# EAGLE design teploblinscheme (EAGLE 9.6.1)
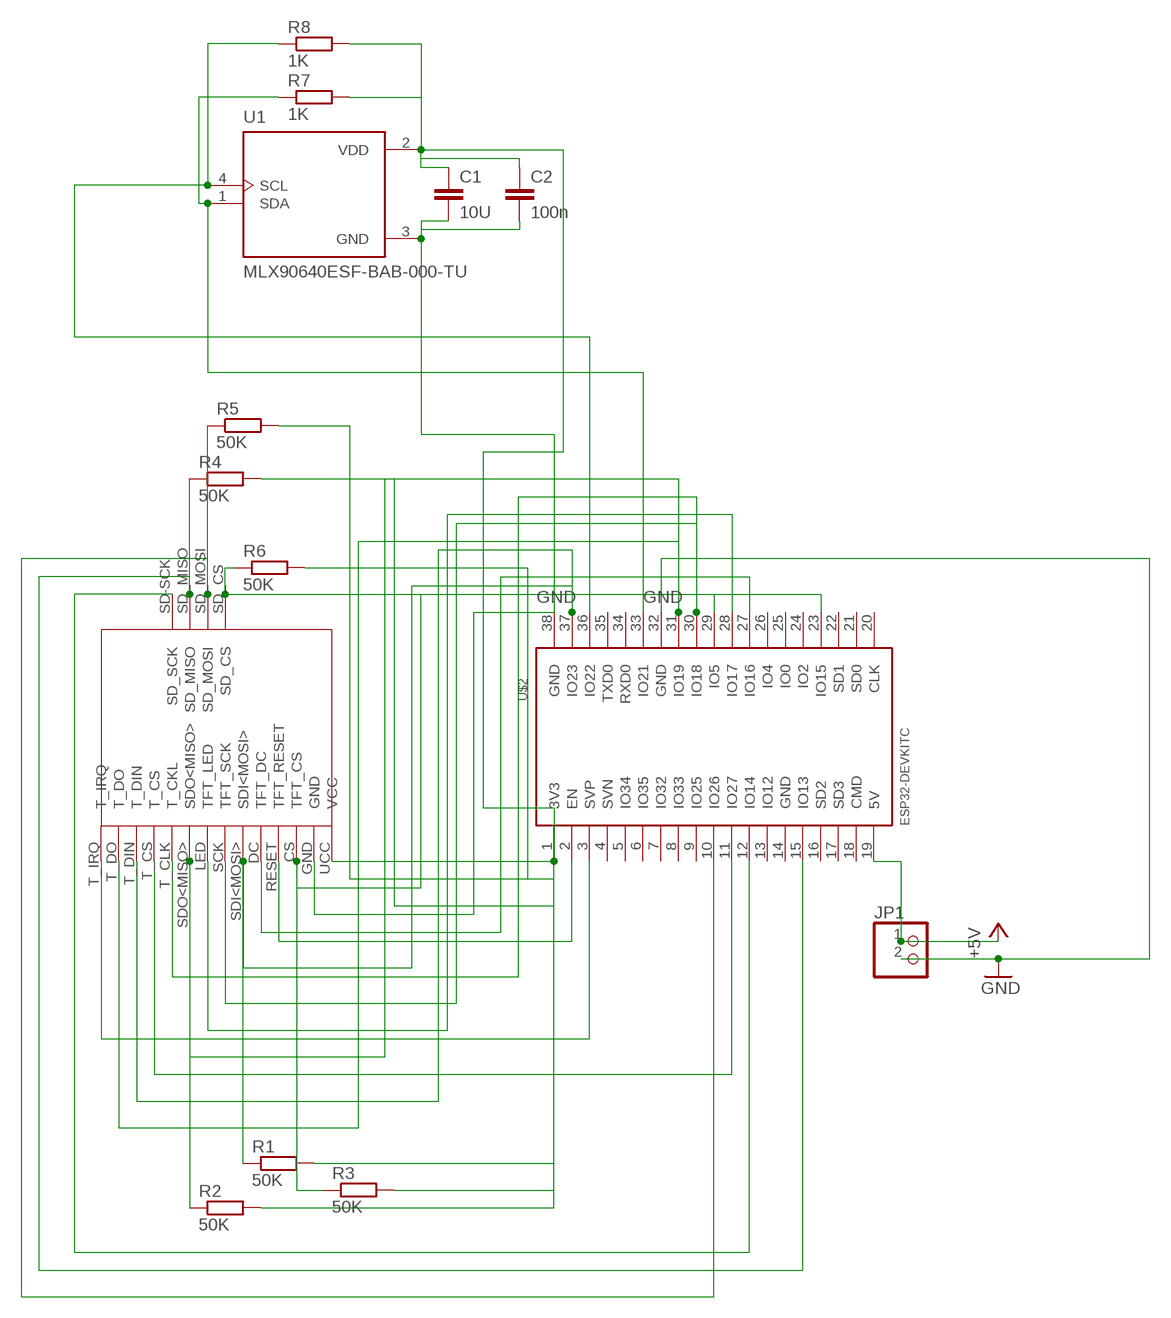
[diagram p0: schematic, sheet 1]

## Parts
C1  10U  C2,5-3  [C2.5-3]
C2  100n  C2,5-3  [C2.5-3]
JP1  PINHD-1X2  [1X02]
R1  50K  R-EU_0207/10  [0207/10]
R2  50K  R-EU_0207/10  [0207/10]
R3  50K  R-EU_0207/10  [0207/10]
R4  50K  R-EU_0207/10  [0207/10]
R5  50K  R-EU_0207/10  [0207/10]
R6  50K  R-EU_0207/10  [0207/10]
R7  1K  R-EU_0204/7  [0204/7]
R8  1K  R-EU_0204/7  [0204/7]
U1  MLX90640ESF-BAB-000-TU  [TO292P945H1165-4]
U$1  ILI9341  [SKR1]
U$2  ESP32DEVKITC  [ESP32-DEVKITC]

## Nets
+5V [supplay]: JP1.1 U$2.19(5V)
GND: C1.2 C2.2 JP1.2 U1.3(GND) U$2.32(GND)
N$1: U$1.SCK(TFT_SCK) U$1.T_CLK(T_CKL) U$2.30(IO18)
N$2 [supplay]: R1.2 R2.2 R3.2 R4.2 R5.2 R6.2 U$1.UCC(VCC) U$2.1(3V3)
N$3: U$1.LED(TFT_LED) U$2.28(IO17)
N$4 [supplay]: R3.1 U$1.CS(TFT_CS) U$2.29(IO5)
N$5: U$1.RESET(TFT_RESET) U$2.2(EN)
N$6: U$1.DC(TFT_DC) U$2.27(IO16)
N$7 [supplay]: R1.1 U$1.SDI<MOSI> U$1.T_DIN U$2.37(IO23)
N$8 [supplay]: R2.1 U$1.SDO<MISO> U$1.T_DO U$2.31(IO19)
N$9: U$1.GND U$2.38(GND)
N$10 [supplay]: R4.1 U$1.SD_MISO U$2.15(IO13)
N$11: U$1.T_CS U$2.11(IO27)
N$12 [supplay]: R5.1 U$1.SD_MOSI U$2.10(IO26)
N$13 [supplay]: R6.1 U$1.SD_CS U$2.23(IO15)
N$14: U$1.T_IRQ U$2.3(SVP)
N$15 [supplay]: R8.1 U1.4(SCL) U$2.36(IO22)
N$16 [supplay]: C1.1 C2.1 R7.2 R8.2 U1.2(VDD)
N$17 [supplay]: R7.1 U1.1(SDA) U$2.33(IO21)
N$18: U$1.SD-SCK(SD_SCK) U$2.12(IO14)
Unconnected: U$2.4(SVN) U$2.5(IO34) U$2.6(IO35) U$2.7(IO32) U$2.8(IO33) U$2.9(IO25) U$2.13(IO12) U$2.14(GND) U$2.16(SD2) U$2.17(SD3) U$2.18(CMD) U$2.20(CLK) U$2.21(SD0) U$2.22(SD1) U$2.24(IO2) U$2.25(IO0) U$2.26(IO4) U$2.34(RXD0) U$2.35(TXD0)

## Library data of the parts
C1 C2 = capacitor-wima:C: CAPACITOR naming: grid - package width
JP1 = pinhead:PINHD-1X2: PIN HEADER
R1-R8 = rcl:R-EU_: RESISTOR, European symbol; SPICEPREFIX: R
U1 = teploblinEkran:MLX90640ESF-BAB-000-TU: SENSOR DGTL -40C-85C TO39; AVAILABILITY: Unavailable; DESCRIPTION: Thermal Image Sensor 32H x 24V TO-39; MF: Melexis Technologies NV; MP: MLX90640ESF-BAB-000-TU; PACKAGE: TO-39 Melexis Technologies NV; PRICE: None
U$1 = teploblinEkran:ILI9341
U$2 = teploblinEkran:ESP32DEVKITC

## Net classes
0 default: width 0.406 mm
1 supplay: width 0.813 mm

## Board
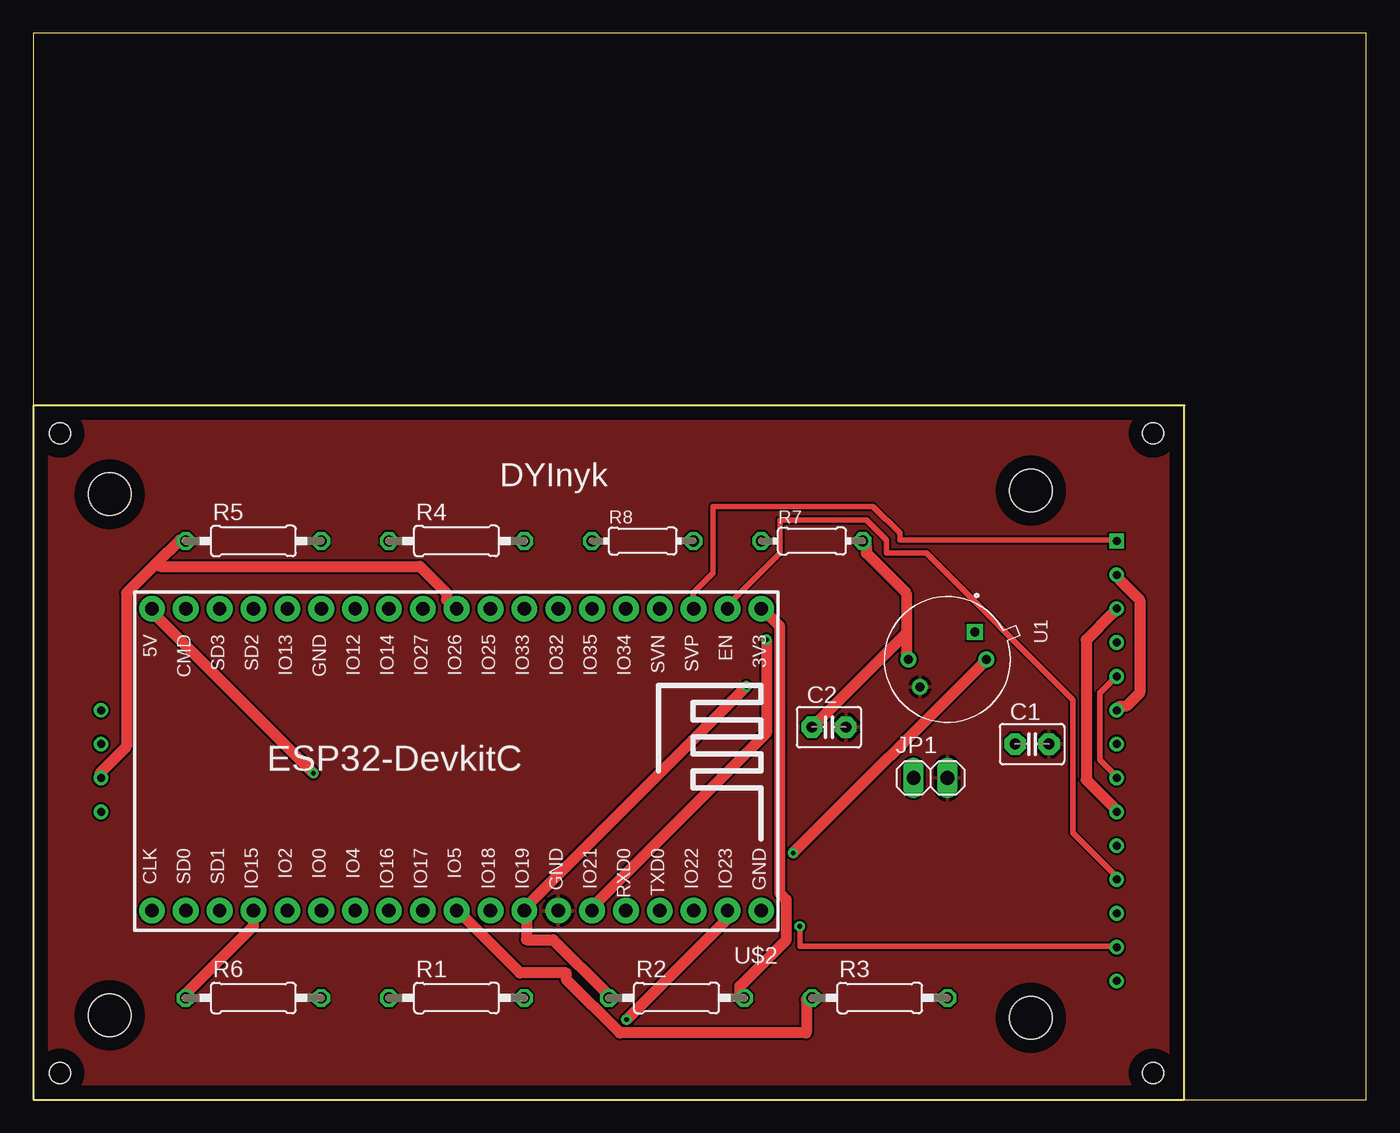
[diagram p1: board, top side]
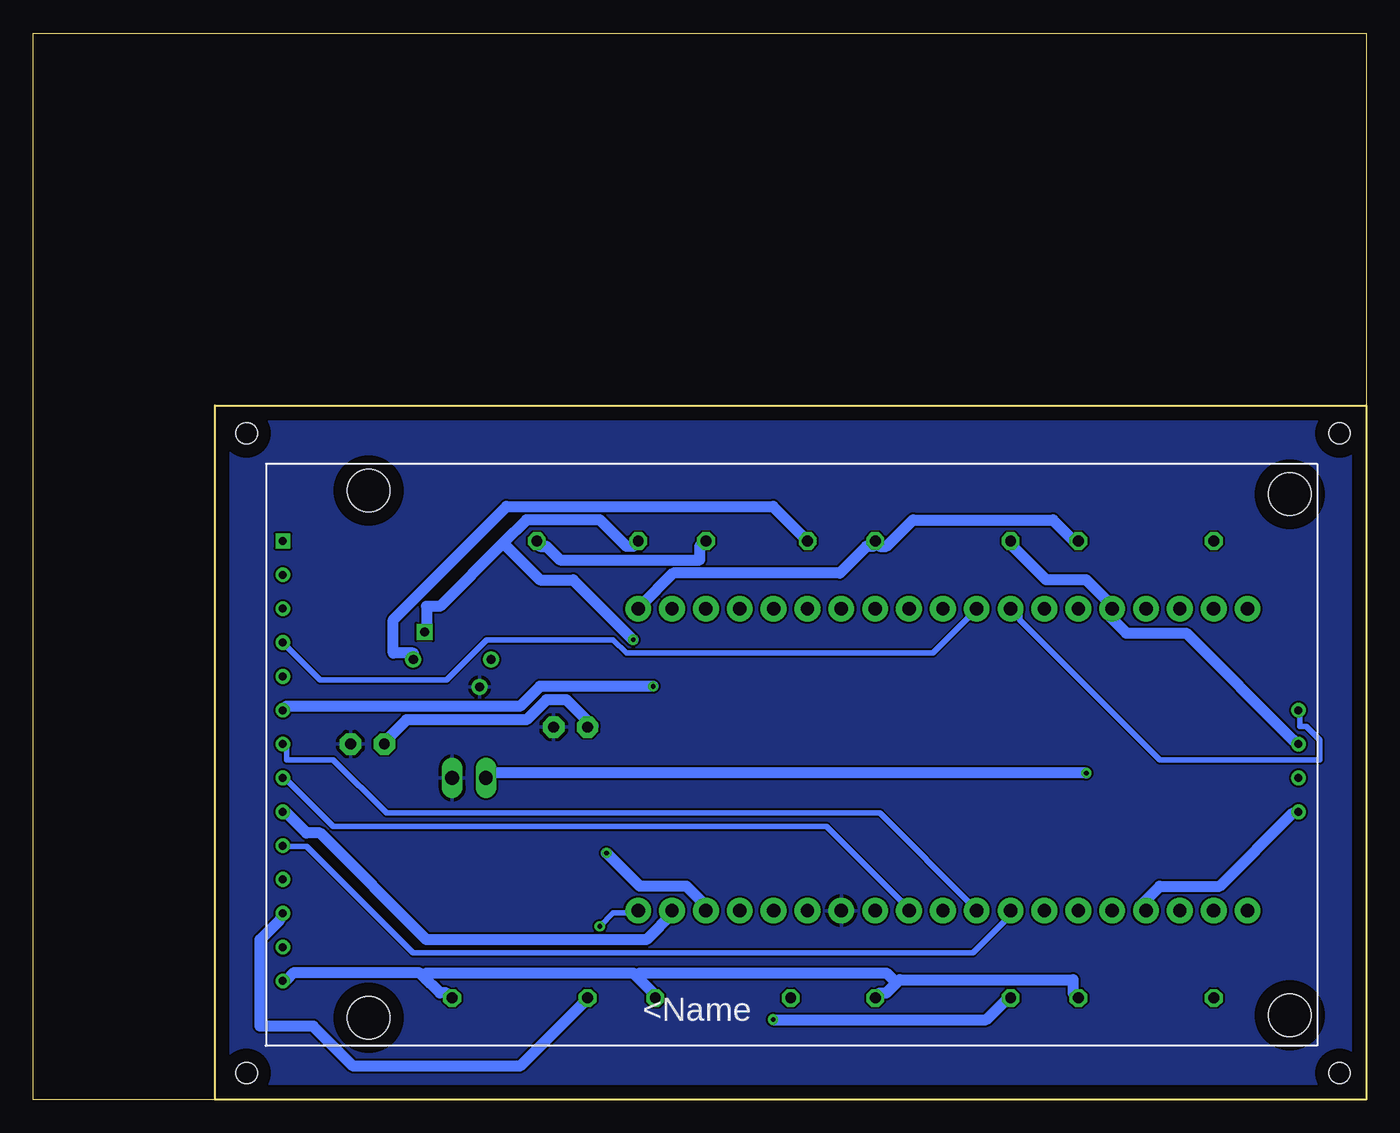
[diagram p2: board, bottom side, seen from below]

Size 100 x 80 mm. Coordinates in mm from the lower left corner, seen from the top.
Outline: 86.36,0 100,0 100,80 0,80 0,52.07
Outline: 0,52.07 0,0 86.36,0
Outline: 86.36,0 86.36,52.07 0,52.07
Copper layers (1*16): Top 0.035mm / dielectric 1.5mm / Bottom 0.035mm
Design rules "default": minimum track width 6mil, minimum drill 0.35mm, track to track 6mil, track to pad 6mil, pad to pad 6mil, via to via 6mil, smd to smd 6mil, copper to edge 40mil, drill to drill 6mil, minimum pad ring 10mil, minimum via ring 8mil, stop-mask expansion 4mil, vias tented up to drill 0mil, thermal gap 10mil
Holes 1.6 mm at 2,50 2,2 84,2 84,50

### Footprints (pad centres in the part's own frame; a part is rotated, then mirrored left to right if it is on the bottom)
C2.5-3 = drill 0.813 pad 1.6 octagon: 1 -1.27,0; 2 1.27,0
1X02 = drill 1.016 long: 1 -1.27,0; 2 1.27,0
0207/10 = drill 0.813 octagon: 1 -5.08,0; 2 5.08,0
0204/7 = drill 0.813 octagon: 1 -3.81,0; 2 3.81,0
TO292P945H1165-4 = drill 0.7 pad 1.1 square: 1 -2.065,2.067 | drill 0.7 pad 1.1: 2 0,-2.92; 3 2.065,-2.065; 4 0,2.92
SKR1 = drill 0.6: CS -5.08,0; DC -10.16,0; GND -2.54,0; LED -17.78,0; RESET -7.62,0; SCK -15.24,0; SD-SCK -20.32,76.2; SD_CS -12.7,76.2; SD_MISO -17.78,76.2; SD_MOSI -15.24,76.2; SDI<MOSI> -12.7,0; SDO<MISO> -20.32,0; T_CLK -22.86,0; T_CS -25.4,0; T_DIN -27.94,0; T_DO -30.48,0; UCC 0,0 | drill 0.6 square: T_IRQ -33.02,0 | hole 3.2: -36.525,75.54; 2.565,75.54; 2.76,6.44; -36.8,6.44
ESP32-DEVKITC = drill 1 pad 1.93: 1 -22.87,-11.42; 2 -20.33,-11.42; 3 -17.79,-11.42; 4 -15.25,-11.42; 5 -12.71,-11.42; 6 -10.17,-11.42; 7 -7.63,-11.42; 8 -5.09,-11.42; 9 -2.55,-11.42; 10 -0.01,-11.42; 11 2.53,-11.42; 12 5.07,-11.42; 13 7.61,-11.42; 14 10.15,-11.42; 15 12.69,-11.42; 16 15.23,-11.42; 17 17.77,-11.42; 18 20.31,-11.42; 19 22.85,-11.42; 20 22.85,11.23; 21 20.31,11.23; 22 17.77,11.23; 23 15.23,11.23; 24 12.69,11.23; 25 10.15,11.23; 26 7.61,11.23; 27 5.07,11.23; 28 2.53,11.23; 29 -0.01,11.23; 30 -2.55,11.23; 31 -5.09,11.23; 32 -7.63,11.23; 33 -10.17,11.23; 34 -12.71,11.23; 35 -15.25,11.23; 36 -17.79,11.23; 37 -20.33,11.23; 38 -22.87,11.23

### Placement (x,y rotation side)
C1  74.93,26.67 0 top
C2  59.69,27.94 0 top
JP1  67.31,24.13 0 top
R1  31.75,7.62 0 top
R2  48.26,7.62 0 top
R3  63.5,7.62 0 top
R4  31.75,41.91 0 top
R5  16.51,41.91 0 top
R6  16.51,7.62 0 top
R7  58.42,41.91 0 top
R8  45.72,41.91 0 top
U1  68.58,33.02 270 top
U$1  81.28,8.89 270 bottom
U$2  31.75,25.4 180 top

### Tracks (layer width: path | path; a pad name or v marks a point on that pad's centre or on a via)
+5V  (via drill 0.35)
  Top 0.813: v21,24.5 9,36.5 U$2.19
  Bottom 0.813: v21,24.5 66,24.5 JP1.1
GND
  pour Bottom: 0,53 0,0 89,0 89,52 87,54 1,54
  pour Top: 0,54 0,0 91,0 91,54 89,56 2,56
N$1
  Top 0.406: U$1.SCK 81,24.5 80,25.5 80,30.5 81,31.5 U$1.T_CLK
  Bottom 0.406: U$2.30 34.5,14.5 40.5,20.5 77.5,20.5 81,24 U$1.SCK
N$2
  Top 0.813: U$2.1 55,36.5 56,35.5 56,15.5 56.5,15 56.5,12 53,8.5 53,8 R2.2
  Bottom 0.813: R5.2 22,42 23.5,43.5 34,43.5 36,41.5 36.5,41.5 R4.2 37,41.5 37.5,41.5 39.5,39.5 52,39.5 54.5,37 U$2.1 | 35.25,8.75 36,8 36.5,8 R1.2 | 35.25,8.75 35,9 22,9 22,8 R6.2 | 70.75,9.25 69.5,8 69,8 R3.2 | 70.75,9.25 71,9.5 80.5,9.5 81,9 U$1.UCC | 54.75,9.25 55,9.5 70.5,9.5 70.75,9.25 | 54.75,9.25 53.5,8 R2.2 | 35.25,8.75 36,9.5 54.5,9.5 54.75,9.25
N$3
  Bottom 0.406: U$1.LED 81,26.5 81,25.5 77.5,25.5 73.5,21.5 36.5,21.5 29.5,14.5 U$2.28
N$4
  Top 0.813: U$2.29 32,14 36.5,9.5 40,9.5 40,9 44,5 58,5 58,7.5 R3.1
  Bottom 0.813: U$1.CS 81.5,13.5 83,12 83,5.5 79,5.5 76,2.5 63.5,2.5 58.5,7.5 R3.1
N$5
  Top 0.406: U$1.RESET 81,17 78,20 78,30 67,41 64,41 64,42 62.5,43.5 56,43.5 56,41 52.5,37.5 52.5,37 U$2.2
N$6
  Bottom 0.406: U$1.DC 81,19 79.5,19 71.5,11 29.5,11 26.5,14 U$2.27
N$7  (via drill 0.35)
  Top 0.813: U$1.SDI<MOSI> 81,22 79,24 79,34.5 81,36.5 U$1.T_DIN | v44.5,6 52,13.5 52,14 U$2.37
  Bottom 0.813: v44.5,6 28.5,6 27,7.5 R1.1 | U$1.SDI<MOSI> 81,21.5 79.5,20 78.5,20 70.5,12 54,12 52,14 U$2.37
N$8  (via drill 0.35)
  Top 0.813: U$1.SDO<MISO> 81.5,29.5 82,29.5 83,30.5 83,37.5 81.5,39 U$1.T_DO | R2.1 43,8 39,12 37,12 37,14 U$2.31 37,14.5 v53.5,31
  Bottom 0.813: v53.5,31 62,31 63.5,29.5 81,29.5 U$1.SDO<MISO>
N$9  (via drill 0.35)
  Top 0.406: v57.5,13 57.5,11.5 81,11.5 U$1.GND
  Bottom 0.406: v57.5,13 56.5,14 55,14 U$2.38
N$10
  Bottom 0.813: U$1.SD_MISO 5.5,27 13.5,35 18,35 19.5,36.5 U$2.15 19,37 21,39 24,39 26.5,41.5 R4.1
N$11
  Bottom 0.406: U$1.T_CS 81,34 78.5,31.5 69,31.5 66,34.5 56.5,34.5 55.5,33.5 32.5,33.5 29.5,36.5 U$2.11
N$12
  Top 0.813: 9.25,40.25 11,42 R5.1 | 9.25,40.25 7,38 7,26.5 5,24.5 U$1.SD_MOSI | U$2.10 31.5,37 31,37.5 31,38 29,40 9.5,40 9.25,40.25
N$13
  Top 0.813: R6.1 11.5,8 16.5,13 16.5,14 U$2.23
  Bottom 0.813: U$1.SD_CS 5.5,21.5 11,16 15.5,16 17,14.5 U$2.23
N$14
  Top 0.406: U$1.T_IRQ 81,42 65,42 65,42.5 63,44.5 51,44.5 51,39.5 49.5,38 49.5,37 U$2.3
N$15  (via drill 0.35)
  Top 0.813: v57,18.5 71.5,33 U1.4
  Bottom 0.813: v57,18.5 54.5,16 51,16 49.5,14.5 U$2.36 | R8.1 44.5,44.5 64.5,44.5 73,36 73,33.5 71.5,33.5 U1.4
N$16
  Top 0.813: 65.5,35 65.5,38 62.5,41 62.5,41.5 R7.2 | 65.5,35 65.5,33.5 U1.2 | 65.5,35 58.5,28 C2.1
  Bottom 0.813: R8.2 50,41.5 50,40.5 60.5,40.5 61.5,41.5 62,41.5 R7.2 | C1.1 73.5,27 72,28.5 63,28.5 61.5,30 60,30 58,28 C2.1
N$17  (via drill 0.35)
  Top 0.813: v55,34.5 55,27.5 42,14.5 U$2.33
  Bottom 0.813: 64.75,41.75 63,43.5 57.5,43.5 55.5,41.5 55,41.5 R7.1 | 64.75,41.75 69.5,37 70.5,37 70.5,35.5 U1.1 | v55,34.5 59.5,39 62,39 64.75,41.75
N$18
  Bottom 0.406: U$1.SD-SCK 5,29 5,28 4.5,28 3.5,27 3.5,25.5 15.5,25.5 26,36 26,36.5 26.5,36.5 U$2.12

### Text on the board
tNames: DYInyk